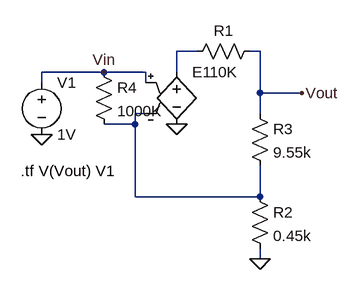
[diagram p0: schematic vcvs feedback.asc]
vcvs feedback.asc, the LTspice schematic file:
Version 4
SHEET 1 880 680
WIRE 256 96 224 96
WIRE 352 96 336 96
WIRE 112 128 16 128
WIRE 176 128 112 128
WIRE 224 128 224 96
WIRE 16 144 16 128
WIRE 176 144 176 128
WIRE 352 160 352 96
WIRE 416 160 352 160
WIRE 176 192 160 192
WIRE 352 192 352 160
WIRE 160 208 160 192
WIRE 160 208 112 208
WIRE 160 320 160 208
WIRE 352 320 352 272
WIRE 352 320 160 320
WIRE 352 416 352 400
FLAG 224 208 0
FLAG 416 160 Vout
FLAG 112 128 Vin
FLAG 352 416 0
FLAG 16 224 0
SYMBOL voltage 16 128 R0
WINDOW 123 0 0 Left 0
WINDOW 39 0 0 Left 0
SYMATTR InstName V1
SYMATTR Value 1V
SYMBOL e 224 112 R0
WINDOW 3 24 96 Invisible 2
SYMATTR Value 200
SYMATTR InstName E1
SYMBOL res 336 304 R0
SYMATTR InstName R2
SYMATTR Value 0.45k
SYMBOL res 336 176 R0
SYMATTR InstName R3
SYMATTR Value 9.55k
SYMBOL res 352 80 R90
WINDOW 0 0 56 VBottom 2
WINDOW 3 32 56 VTop 2
SYMATTR InstName R1
SYMATTR Value 10K
SYMBOL res 96 112 R0
SYMATTR InstName R4
SYMATTR Value 1000K
TEXT -16 280 Left 2 !.tf V(Vout) V1

The netlist it stands for:
* vcvs feedback.asc
V1 Vin 0 1V
E1 N001 0 Vin N002 200
R2 N002 0 0.45k
R3 Vout N002 9.55k
R1 Vout N001 10K
R4 Vin N002 1000K
.tf V(Vout) V1
.backanno
.end